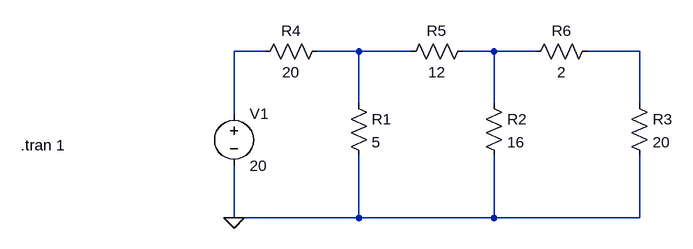
[diagram p0: schematic Draft1.asc]
Draft1.asc, the LTspice schematic file:
Version 4.1
SHEET 1 880 680
WIRE -32 80 -80 80
WIRE 112 80 48 80
WIRE 192 80 112 80
WIRE 320 80 272 80
WIRE 384 80 320 80
WIRE 544 80 464 80
WIRE 112 160 112 80
WIRE 320 160 320 80
WIRE 544 160 544 80
WIRE -80 176 -80 80
WIRE -80 336 -80 256
WIRE 112 336 112 240
WIRE 112 336 -80 336
WIRE 320 336 320 240
WIRE 320 336 112 336
WIRE 544 336 544 240
WIRE 544 336 320 336
FLAG -80 336 0
SYMBOL res 96 144 R0
SYMATTR InstName R1
SYMATTR Value 5
SYMBOL res 304 144 R0
SYMATTR InstName R2
SYMATTR Value 16
SYMBOL res 64 64 R90
WINDOW 0 0 56 VBottom 2
WINDOW 3 32 56 VTop 2
SYMATTR InstName R4
SYMATTR Value 20
SYMBOL res 288 64 R90
WINDOW 0 0 56 VBottom 2
WINDOW 3 32 56 VTop 2
SYMATTR InstName R5
SYMATTR Value 12
SYMBOL res 480 64 R90
WINDOW 0 0 56 VBottom 2
WINDOW 3 32 56 VTop 2
SYMATTR InstName R6
SYMATTR Value 2
SYMBOL voltage -80 160 R0
WINDOW 123 0 0 Left 0
WINDOW 39 0 0 Left 0
SYMATTR InstName V1
SYMATTR Value 20
SYMBOL res 528 144 R0
SYMATTR InstName R3
SYMATTR Value 20
TEXT -408 224 Left 2 !.tran 1

The netlist it stands for:
* Draft1.asc
R1 N002 0 5
R2 N003 0 16
R4 N002 N001 20
R5 N003 N002 12
R6 N004 N003 2
V1 N001 0 20
R3 N004 0 20
.tran 1
.backanno
.end